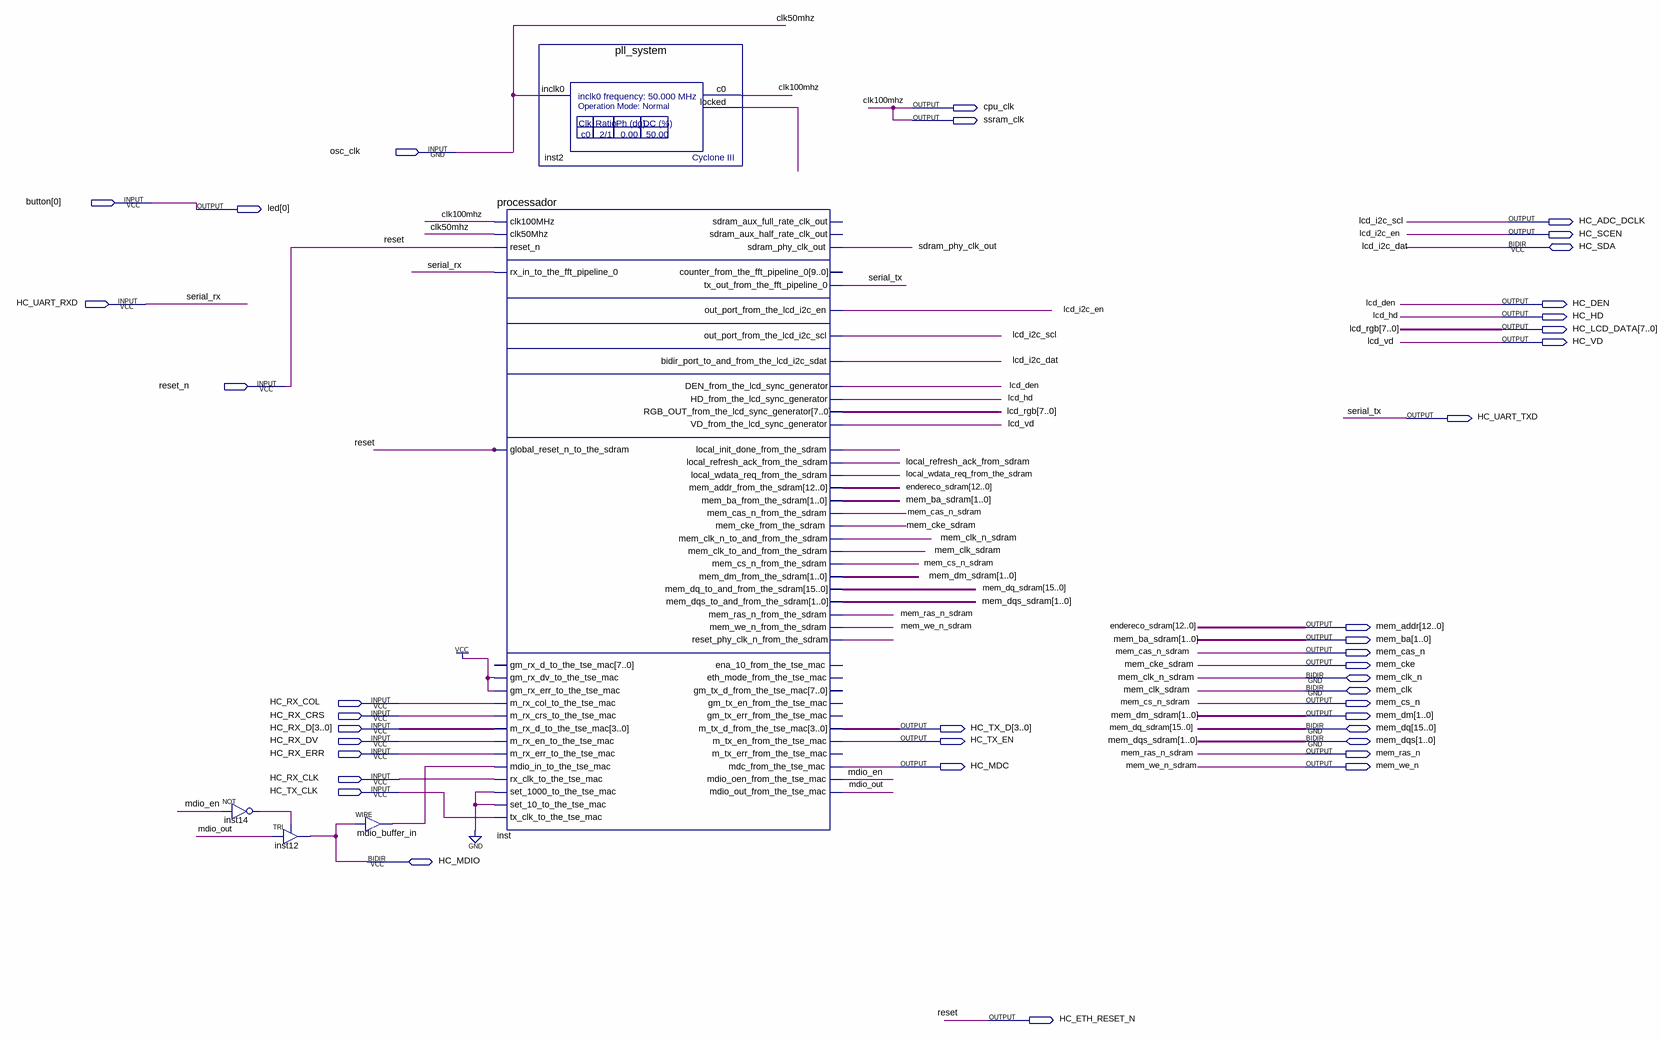
[diagram p0: schematic sheet]
// Quartus schematic imageConvolution.bdf as structural Verilog: 5 symbols, 39 pins
module imageConvolution (
  input  osc_clk,
  input  [0:0] button,
  input  HC_UART_RXD,
  input  reset_n,
  input  HC_RX_COL,
  input  HC_RX_CRS,
  input  [3:0] HC_RX_D,
  input  HC_RX_DV,
  input  HC_RX_ERR,
  input  HC_RX_CLK,
  input  HC_TX_CLK,
  inout  HC_SDA,
  inout  mem_clk_n,
  inout  mem_clk,
  inout  [15:0] mem_dq,
  inout  [1:0] mem_dqs,
  inout  HC_MDIO,
  output cpu_clk,
  output ssram_clk,
  output [0:0] led,
  output HC_ADC_DCLK,
  output HC_SCEN,
  output HC_DEN,
  output HC_HD,
  output [7:0] HC_LCD_DATA,
  output HC_VD,
  output HC_UART_TXD,
  output [12:0] mem_addr,
  output [1:0] mem_ba,
  output mem_cas_n,
  output mem_cke,
  output mem_cs_n,
  output [1:0] mem_dm,
  output [3:0] HC_TX_D,
  output HC_TX_EN,
  output mem_ras_n,
  output HC_MDC,
  output mem_we_n,
  output HC_ETH_RESET_N
);

  wire inst2_locked, inst14_out, inst_local_init_done_from_the_sdram, inst_reset_phy_clk_n_from_the_sdram,
       local_refresh_ack_from_sdram, local_wdata_req_from_the_sdram, mdio_buffer_in_out, mdio_en, mdio_out,
       sdram_phy_clk_out;

  not inst14 (inst14_out, mdio_en);
  TRI inst12 (.IN(mdio_out), .OE(inst14_out), .OUT(HC_MDIO));
  assign mdio_buffer_in_out = HC_MDIO;  // WIRE mdio_buffer_in
  processador inst (
    .clk100MHz(cpu_clk), .clk50Mhz(osc_clk), .reset_n(reset_n), .rx_in_to_the_fft_pipeline_0(HC_UART_RXD),
    .global_reset_n_to_the_sdram(reset_n), .gm_rx_dv_to_the_tse_mac(1'b1), .gm_rx_err_to_the_tse_mac(1'b1),
    .m_rx_col_to_the_tse_mac(HC_RX_COL), .m_rx_crs_to_the_tse_mac(HC_RX_CRS),
    .m_rx_d_to_the_tse_mac(HC_RX_D), .m_rx_en_to_the_tse_mac(HC_RX_DV), .m_rx_err_to_the_tse_mac(HC_RX_ERR),
    .mdio_in_to_the_tse_mac(mdio_buffer_in_out), .rx_clk_to_the_tse_mac(HC_RX_CLK),
    .set_1000_to_the_tse_mac(1'b0), .set_10_to_the_tse_mac(1'b0), .tx_clk_to_the_tse_mac(HC_TX_CLK),
    .sdram_phy_clk_out(sdram_phy_clk_out), .tx_out_from_the_fft_pipeline_0(HC_UART_TXD),
    .out_port_from_the_lcd_i2c_en(HC_SCEN), .out_port_from_the_lcd_i2c_scl(HC_ADC_DCLK),
    .DEN_from_the_lcd_sync_generator(HC_DEN), .HD_from_the_lcd_sync_generator(HC_HD),
    .RGB_OUT_from_the_lcd_sync_generator(HC_LCD_DATA), .VD_from_the_lcd_sync_generator(HC_VD),
    .local_init_done_from_the_sdram(inst_local_init_done_from_the_sdram),
    .local_refresh_ack_from_the_sdram(local_refresh_ack_from_sdram),
    .local_wdata_req_from_the_sdram(local_wdata_req_from_the_sdram), .mem_addr_from_the_sdram(mem_addr),
    .mem_ba_from_the_sdram(mem_ba), .mem_cas_n_from_the_sdram(mem_cas_n), .mem_cke_from_the_sdram(mem_cke),
    .mem_cs_n_from_the_sdram(mem_cs_n), .mem_dm_from_the_sdram(mem_dm), .mem_ras_n_from_the_sdram(mem_ras_n),
    .mem_we_n_from_the_sdram(mem_we_n), .reset_phy_clk_n_from_the_sdram(inst_reset_phy_clk_n_from_the_sdram),
    .m_tx_d_from_the_tse_mac(HC_TX_D), .m_tx_en_from_the_tse_mac(HC_TX_EN), .mdc_from_the_tse_mac(HC_MDC),
    .mdio_oen_from_the_tse_mac(mdio_en), .mdio_out_from_the_tse_mac(mdio_out),
    .bidir_port_to_and_from_the_lcd_i2c_sdat(HC_SDA), .mem_clk_n_to_and_from_the_sdram(mem_clk_n),
    .mem_clk_to_and_from_the_sdram(mem_clk), .mem_dq_to_and_from_the_sdram(mem_dq),
    .mem_dqs_to_and_from_the_sdram(mem_dqs));  // open: gm_rx_d_to_the_tse_mac, sdram_aux_full_rate_clk_out, sdram_aux_half_rate_clk_out, counter_from_the_fft_pipeline_0, ena_10_from_the_tse_mac, eth_mode_from_the_tse_mac, gm_tx_d_from_the_tse_mac, gm_tx_en_from_the_tse_mac, gm_tx_err_from_the_tse_mac, m_tx_err_from_the_tse_mac
  pll_system inst2 (.inclk0(osc_clk), .c0(cpu_clk), .locked(inst2_locked));

  assign HC_ETH_RESET_N = reset_n;
  assign led[0] = button[0];
  assign ssram_clk = cpu_clk;

  // Other names for the same wires on the sheet: clk50mhz = osc_clk; endereco_sdram[12:0] = mem_addr;
  //   lcd_den = HC_DEN; lcd_hd = HC_HD; lcd_i2c_dat = HC_SDA; lcd_i2c_en = HC_SCEN; lcd_i2c_scl = HC_ADC_DCLK;
  //   lcd_rgb[7:0] = HC_LCD_DATA; lcd_vd = HC_VD; mem_ba_sdram[1:0] = mem_ba; mem_cas_n_sdram = mem_cas_n;
  //   mem_cke_sdram = mem_cke; mem_clk_n_sdram = mem_clk_n; mem_clk_sdram = mem_clk; mem_cs_n_sdram = mem_cs_n;
  //   mem_dm_sdram[1:0] = mem_dm; mem_dq_sdram[15:0] = mem_dq; mem_dqs_sdram[1:0] = mem_dqs;
  //   mem_ras_n_sdram = mem_ras_n; mem_we_n_sdram = mem_we_n; reset = reset_n; serial_rx = HC_UART_RXD;
  //   serial_tx = HC_UART_TXD; clk100mhz = cpu_clk
endmodule
